# Altium schematic sheet rf.SchDoc: RF
size A4; CheckedBy: None; DrawnBy: David, Andrea; DocumentNumber: 6; SheetNumber: 6; SheetTotal: 7; Project: Hefesto; VersionRevision: v1.0; SPICEModelCacheBOYTSJFF: <root> / <DocumentId>BOYTSJFF</DocumentId> / <CacheFrame Number="0"> / <Model Name="cap" Kind="MDL"> / <Text>*Default semiconductor capacitor / .MODEL CAP C()</Text> / </Model> / </CacheFrame> / </root>; TotalSheet: 7; Company: ETSIT
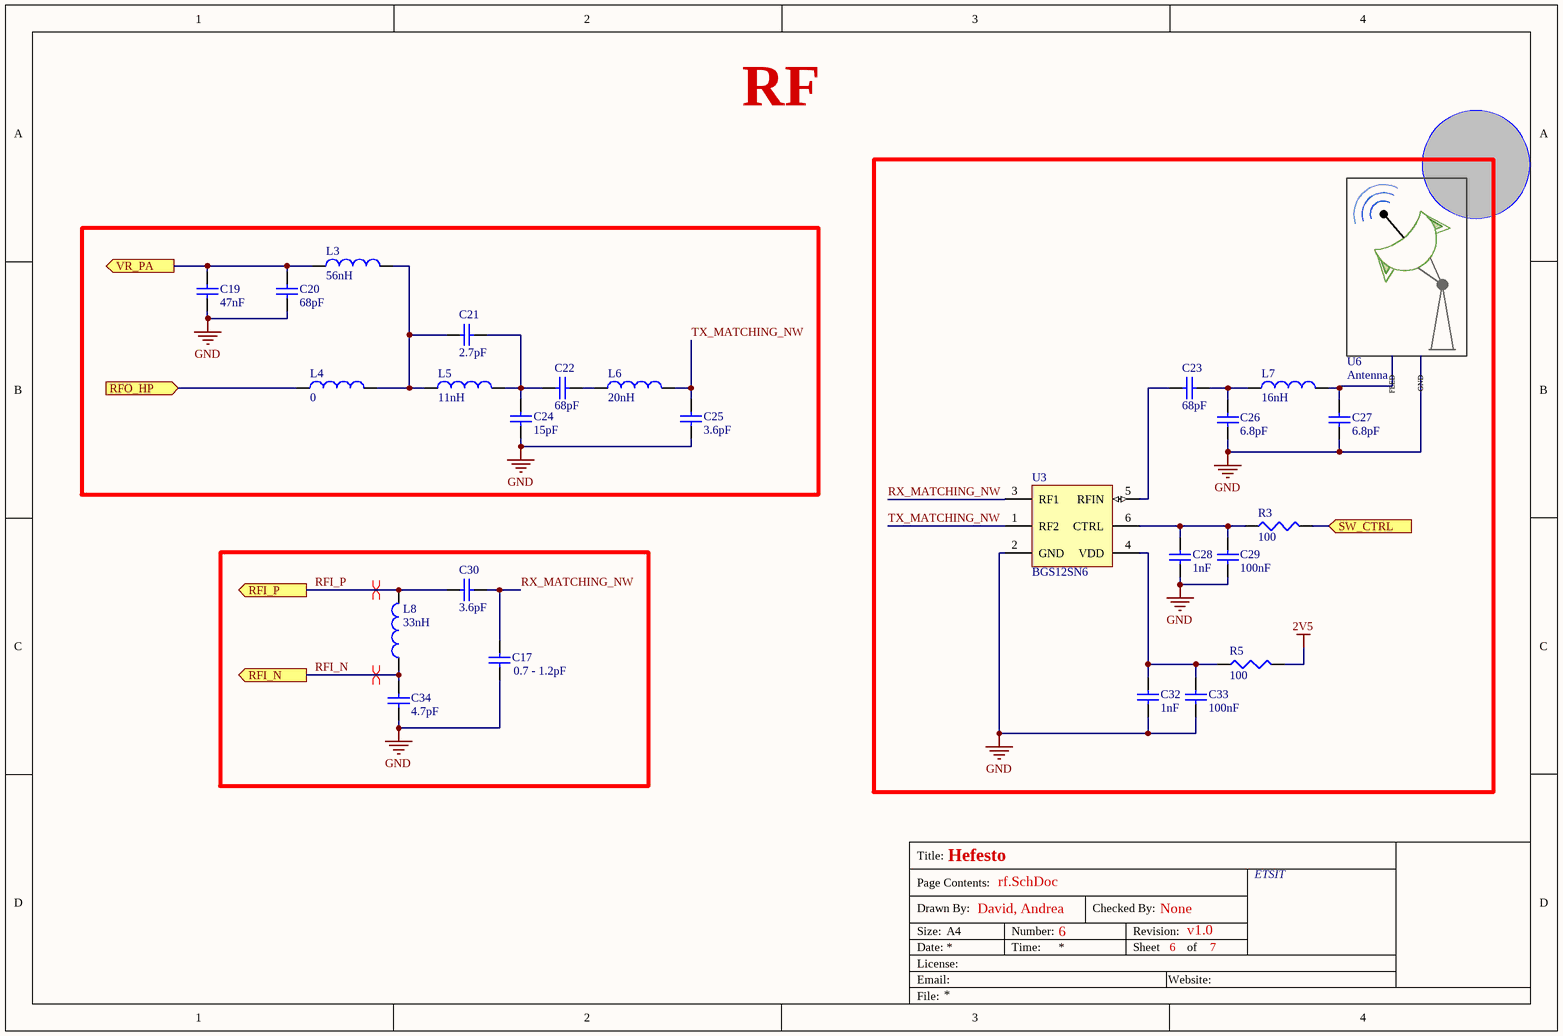
[diagram p0: rf.SchDoc]

## Parts
C17  value 0.7 - 1.2pF  [1608[0603]]  (hidden comment: Cap Semi)
C19  value 47nF  [1608[0603]]  (hidden comment: Cap Semi)
C20  value 68pF  [1608[0603]]  (hidden comment: Cap Semi)
C21  value 2.7pF  [1608[0603]]  (hidden comment: Cap Semi)
C22  value 68pF  [1608[0603]]  (hidden comment: Cap Semi)
C23  value 68pF  [1608[0603]]  (hidden comment: Cap Semi)
C24  value 15pF  [1608[0603]]  (hidden comment: Cap Semi)
C25  value 3.6pF  [1608[0603]]  (hidden comment: Cap Semi)
C26  value 6.8pF  [1608[0603]]  (hidden comment: Cap Semi)
C27  value 6.8pF  [1608[0603]]  (hidden comment: Cap Semi)
C28  value 1nF  [1608[0603]]  (hidden comment: Cap Semi)
C29  value 100nF  [1608[0603]]  (hidden comment: Cap Semi)
C30  value 3.6pF  [1608[0603]]  (hidden comment: Cap Semi)
C32  value 1nF  [1608[0603]]  (hidden comment: Cap Semi)
C33  value 100nF  [1608[0603]]  (hidden comment: Cap Semi)
C34  value 4.7pF  [1608[0603]]  (hidden comment: Cap Semi)
L3  value 56nH  [0603]  (hidden comment: Inductor)
L4  value 0  [0603]  (hidden comment: Inductor)
L5  value 11nH  [0603]  (hidden comment: Inductor)
L6  value 20nH  [0603]  (hidden comment: Inductor)
L7  value 16nH  [0603]  (hidden comment: Inductor)
L8  value 33nH  [0603]  (hidden comment: Inductor)
R3  value 100  [J1-0603]  (hidden comment: Res3)
R5  value 100  [J1-0603]  (hidden comment: Res3)
U3  BGS12SN6  [INF-TSNP-6-2_V]
U6  Antenna  [Antenna_SWRA228]

## Ports
RFI_N (out, see main[3C], soc[2D]), RFI_P (out, see main[3C], soc[1D]), RFO_HP (in, see main[2C], soc[2D]), SW_CTRL (in, see main[3C]), VR_PA (out, see main[2C], soc[2D])

## Nets
2V5: R5.2
GND: C17.1 C19.1 C20.1 C24.1 C25.1 C26.2 C27.2 C28.2 C29.2 C32.2 C33.2 C34.1 U3.2(GND) U6.0(GND)
RFI_N: C34.2 L8.1 ; port RFI_N
RFI_P: C30.2 L8.2 ; port RFI_P
RFO_HP: L4.1 ; port RFO_HP
RX_MATCHING_NW: C17.2 C30.1 U3.3(RF1)
SW_CTRL: R3.2 ; port SW_CTRL
TX_MATCHING_NW: C25.2 L6.2 U3.1(RF2)
VR_PA: C19.2 C20.2 L3.1 ; port VR_PA
NetC21_1: C21.1 C22.2 C24.2 L5.2
NetC21_2: C21.2 L3.2 L4.2 L5.1
NetC22_1: C22.1 L6.1
NetC23_1: C23.1 C26.1 L7.1
NetC23_2: C23.2 U3.5(RFIN)
NetC27_1: C27.1 L7.2 U6.1(FEED)
NetC28_1: C28.1 C29.1 R3.1 U3.6(CTRL)
NetC32_1: C32.1 C33.1 R5.1 U3.4(VDD)

## Layout directives
differential pair: RFI_N, RFI_P

## Notes on the sheet
- Title:
- Drawn By:
- Page Contents:
- Checked By:
- Size:
- Date:
- File:
- License:
- Email:
- A4
- Number:
- Time:
- Revision:
- Sheet
- Website:
- of

## Library data of the parts
C17 C19-C30 C32-C34 = Cap Semi: Capacitor (Semiconductor SIM Model); Published: 8-Jun-2000; LatestRevisionDate: 29-May-2009; LatestRevisionNote: IPC-7351 Footprint Added.; PackageReference: C1206; Publisher: Altium Limited; PackageDescription: Chip Capacitor
L3-L8 = Inductor: Code_IEC: 1005; Published: 8-Jun-2000; LatestRevisionDate: 29-May-2009; LatestRevisionNote: IPC-7351 Footprint Added.; PackageReference: 0402-A; Publisher: Altium Limited; PackageDescription: Chip Inductor; Code_JEITA: 0402
R3 R5 = Res3: Resistor; Published: 8-Jun-2000; LatestRevisionDate: 29-May-2009; LatestRevisionNote: IPC-7351 Footprint Added.; PackageReference: J1-0603; Publisher: Altium Limited; PackageDescription: Chip Resistor
U3 = CMP-1088-00016-1: Wideband RF SPDT Switch, 0.1 to 6 GHz, TSNP-6, Reel, Green; Manufacturer: Infineon; Green: TRUE; Supply Voltage Range: 1.8 - 3.5; Packing: Tape and Reel; Isolation @1GHz: 40 dB; Insertion Loss @1GHz: 0.25 dB; Pmax: 30 dBm; ComponentLink2URL: http://www.infineon.com/dgdl/BGS12SN6_2014-05-23.pdf?folderId=db3a30431f848401011fcbf2ab4c04c4&fileId=db3a30433f1b26e8013f2db58bc03856; PackageReference: TSNP-6-2; PartNumber: BGS12SN6; DatasheetVersion: Rev. 1.2; ComponentLink3URL: http://www.infineon.com/dgdl/TSNP-6-2-Package_Overview.pdf?folderId=db3a304327b89750012805e1379a6124&fileId=db3a30433c6612b1013c6bcb02293ba1; ComponentLink2Description: Datasheet; PackageDescription: 6-Pin Thin Small Non Leaded Package, 1.1 x 0.7 mm Body, 0.4 mm Pitch; ComponentLink1URL: http://www.infineon.com/; Frequency ( f ) Range: 0.1 to 6 GHz; Switch Type: SPDT; Mounting Technology: Surface Mount; Halogen-free: TRUE; PackageVersion: Jan-13; ComponentLink3Description: Package Specification; ComponentLink1Description: Manufacturer URL